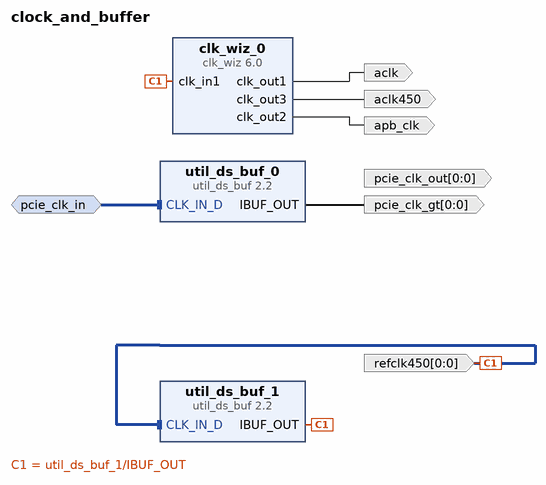
[diagram p0: block diagram of the top level]
# Vivado block design clock_and_buffer, xcvu37p-fsvh2892-2-e, Vivado 2024.1
create_bd_design clock_and_buffer

create_bd_intf_port -mode Slave -vlnv xilinx.com:interface:diff_clock_rtl:1.0 pcie_clk_in
create_bd_intf_port -mode Slave -vlnv xilinx.com:interface:diff_clock_rtl:1.0 refclk450
set_property -dict {CONFIG.FREQ_HZ 450000000} [get_bd_intf_ports refclk450]
create_bd_port -dir O -from 0 -to 0 -type clk pcie_clk_gt
create_bd_port -dir O -from 0 -to 0 -type clk pcie_clk_out
create_bd_port -dir O -type clk aclk
set_property -dict {CONFIG.FREQ_HZ 125000000} [get_bd_ports aclk]
create_bd_port -dir O -type clk apb_clk
create_bd_port -dir O -from 0 -to 0 -type clk refclk450
set_property -dict {CONFIG.FREQ_HZ 450000000} [get_bd_ports refclk450]
create_bd_port -dir O -type clk aclk450
set_property -dict {CONFIG.FREQ_HZ 250000000} [get_bd_ports aclk450]

create_bd_cell -type ip -vlnv xilinx.com:ip:util_ds_buf:2.2 util_ds_buf_0
set_property -dict {CONFIG.C_BUF_TYPE IBUFDS} [get_bd_cells util_ds_buf_0]
create_bd_cell -type ip -vlnv xilinx.com:ip:clk_wiz:6.0 clk_wiz_0
set_property -dict [list \
  CONFIG.CLKIN1_JITTER_PS 22.22 \
  CONFIG.CLKOUT1_JITTER 149.061 \
  CONFIG.CLKOUT1_PHASE_ERROR 164.985 \
  CONFIG.CLKOUT1_REQUESTED_OUT_FREQ 125.000 \
  CONFIG.CLKOUT2_JITTER 155.314 \
  CONFIG.CLKOUT2_PHASE_ERROR 164.985 \
  CONFIG.CLKOUT2_REQUESTED_OUT_FREQ 100.000 \
  CONFIG.CLKOUT2_USED true \
  CONFIG.CLKOUT3_JITTER 131.757 \
  CONFIG.CLKOUT3_PHASE_ERROR 164.985 \
  CONFIG.CLKOUT3_REQUESTED_OUT_FREQ 250.000 \
  CONFIG.CLKOUT3_USED true \
  CONFIG.MMCM_CLKFBOUT_MULT_F 20.000 \
  CONFIG.MMCM_CLKIN1_PERIOD 2.222 \
  CONFIG.MMCM_CLKIN2_PERIOD 10.0 \
  CONFIG.MMCM_CLKOUT0_DIVIDE_F 8.000 \
  CONFIG.MMCM_CLKOUT1_DIVIDE 10 \
  CONFIG.MMCM_CLKOUT2_DIVIDE 4 \
  CONFIG.MMCM_DIVCLK_DIVIDE 9 \
  CONFIG.NUM_OUT_CLKS 3 \
  CONFIG.PRIM_IN_FREQ 450.000 \
  CONFIG.USE_LOCKED false \
  CONFIG.USE_RESET false \
] [get_bd_cells clk_wiz_0]
create_bd_cell -type ip -vlnv xilinx.com:ip:util_ds_buf:2.2 util_ds_buf_1

# ---- connections ----

connect_bd_intf_net -intf_net CLK_IN_D_0_1 [get_bd_intf_ports refclk450] [get_bd_intf_pins util_ds_buf_1/CLK_IN_D]
connect_bd_intf_net [get_bd_intf_ports pcie_clk_in] [get_bd_intf_pins util_ds_buf_0/CLK_IN_D]
connect_bd_net [get_bd_pins clk_wiz_0/clk_out1] [get_bd_ports aclk]
connect_bd_net [get_bd_pins clk_wiz_0/clk_out2] [get_bd_ports apb_clk]
connect_bd_net [get_bd_pins clk_wiz_0/clk_out3] [get_bd_ports aclk450]
connect_bd_net [get_bd_pins util_ds_buf_0/IBUF_OUT] [get_bd_ports pcie_clk_gt]
connect_bd_net [get_bd_pins util_ds_buf_1/IBUF_OUT] [get_bd_ports refclk450] [get_bd_pins clk_wiz_0/clk_in1]

validate_bd_design
save_bd_design
